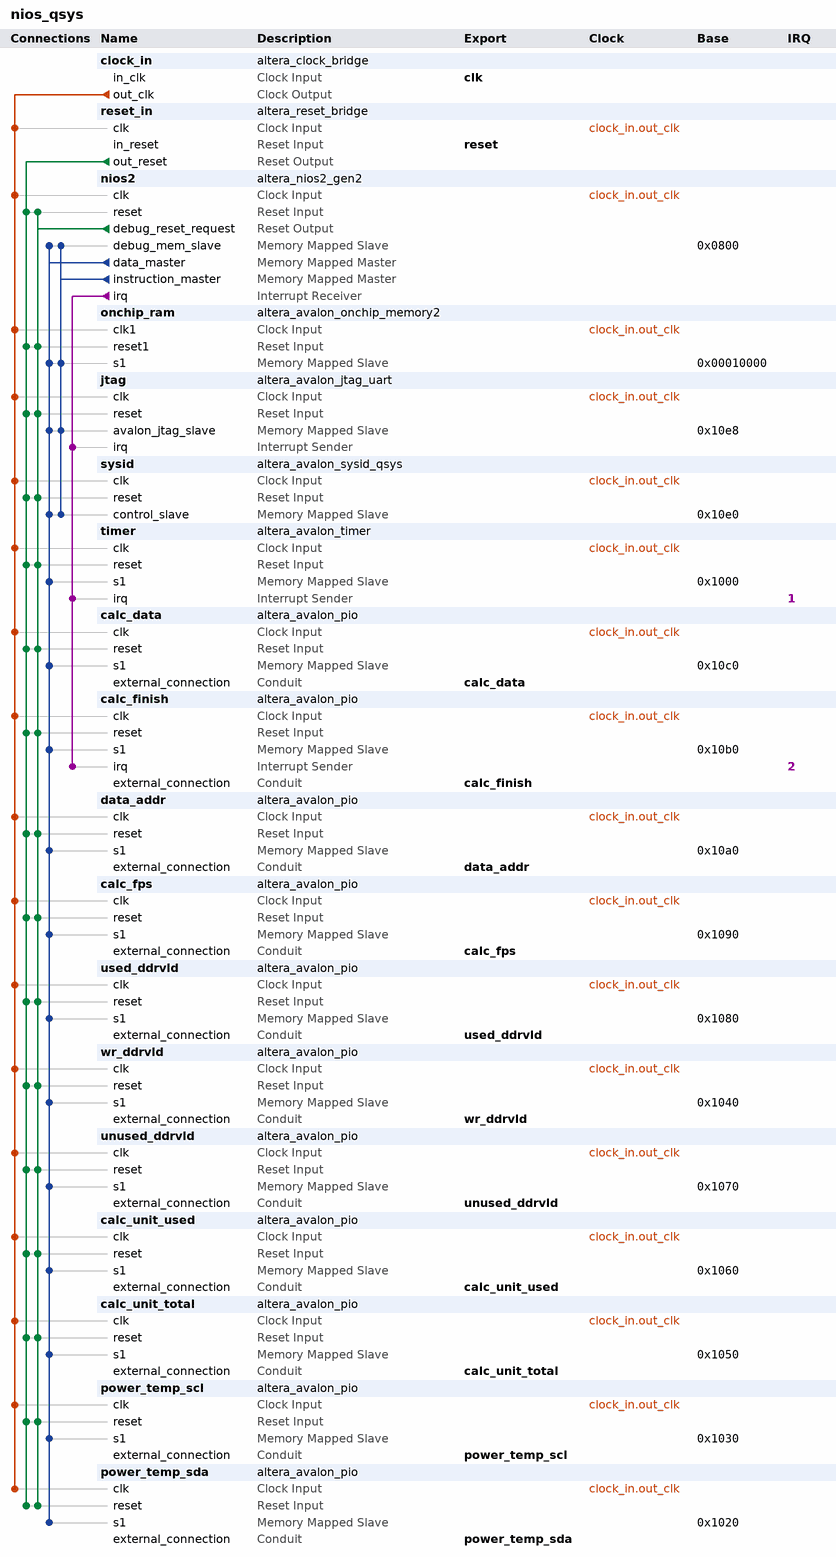
[diagram p0: system contents]
# Platform Designer (Qsys) system nios_qsys, Arria 10 10AX066K3F40E2SG
# Parameters at their usual value, and those the tool derives, are not listed.
package require -exact qsys 1.0
create_system nios_qsys
set_project_property DEVICE_FAMILY {Arria 10}
set_project_property DEVICE 10AX066K3F40E2SG

add_component clock_in ip/nios_qsys/nios_qsys_clock_in.ip altera_clock_bridge clock_in 18.1
load_component clock_in
set_component_parameter_value DERIVED_CLOCK_RATE 0
set_component_parameter_value EXPLICIT_CLOCK_RATE 125000000
save_component

add_component reset_in ip/nios_qsys/nios_qsys_reset_in.ip altera_reset_bridge reset_in 18.1
load_component reset_in
set_component_parameter_value ACTIVE_LOW_RESET 0
set_component_parameter_value SYNCHRONOUS_EDGES deassert
set_component_parameter_value SYNC_RESET 0
save_component

add_component nios2 ip/nios_qsys/nios_qsys_nios2_gen2_0.ip altera_nios2_gen2 nios2 18.1
load_component nios2
set_component_parameter_value resetSlave onchip_ram.s1
set_component_parameter_value exceptionSlave onchip_ram.s1
set_component_parameter_value impl Fast
set_component_parameter_value icache_size 2048
set_component_parameter_value dcache_size 2048
save_component

add_component onchip_ram ip/nios_qsys/nios_qsys_onchip_memory2_0.ip altera_avalon_onchip_memory2 onchip_ram 18.1
load_component onchip_ram
set_component_parameter_value dataWidth 32
set_component_parameter_value dualPort false
set_component_parameter_value initMemContent true
set_component_parameter_value initializationFileName onchip_mem.hex
set_component_parameter_value memorySize 65536
save_component

add_component jtag ip/nios_qsys/nios_qsys_jtag_uart_0.ip altera_avalon_jtag_uart jtag 18.1
load_component jtag
set_component_parameter_value simInteractiveOptions NO_INTERACTIVE_WINDOWS
save_component

add_component sysid ip/nios_qsys/nios_qsys_sysid_qsys_0.ip altera_avalon_sysid_qsys sysid 18.1
load_component sysid
set_component_parameter_value id 0
set_component_parameter_value ID_VALUE 0
set_component_parameter_value TIMESTAMP 0
save_component

add_component timer ip/nios_qsys/nios_qsys_timer_0.ip altera_avalon_timer timer 18.1
load_component timer
set_component_parameter_value period 1
set_component_parameter_value periodUnits SEC
set_component_parameter_value timerPreset FULL_FEATURED
save_component

add_component calc_data ip/nios_qsys/nios_qsys_pio_0.ip altera_avalon_pio calc_data 18.1
load_component calc_data
set_component_parameter_value direction Input
set_component_parameter_value width 32
save_component

add_component calc_finish ip/nios_qsys/nios_qsys_pio_1.ip altera_avalon_pio calc_finish 18.1
load_component calc_finish
set_component_parameter_value captureEdge true
set_component_parameter_value direction Input
set_component_parameter_value generateIRQ true
set_component_parameter_value irqType EDGE
set_component_parameter_value width 1
save_component

add_component data_addr ip/nios_qsys/nios_qsys_pio_2.ip altera_avalon_pio data_addr 18.1
load_component data_addr
set_component_parameter_value direction Output
set_component_parameter_value width 32
save_component

add_component calc_fps ip/nios_qsys/nios_qsys_pio_3.ip altera_avalon_pio calc_fps 18.1
load_component calc_fps
set_component_parameter_value direction Input
set_component_parameter_value width 32
save_component

add_component used_ddrvld ip/nios_qsys/nios_qsys_pio_4.ip altera_avalon_pio used_ddrvld 18.1
load_component used_ddrvld
set_component_parameter_value direction Input
set_component_parameter_value width 32
save_component

add_component wr_ddrvld ip/nios_qsys/nios_qsys_pio_8.ip altera_avalon_pio wr_ddrvld 18.1
load_component wr_ddrvld
set_component_parameter_value direction Input
set_component_parameter_value width 32
save_component

add_component unused_ddrvld ip/nios_qsys/nios_qsys_pio_5.ip altera_avalon_pio unused_ddrvld 18.1
load_component unused_ddrvld
set_component_parameter_value direction Input
set_component_parameter_value width 32
save_component

add_component calc_unit_used ip/nios_qsys/nios_qsys_pio_6.ip altera_avalon_pio calc_unit_used 18.1
load_component calc_unit_used
set_component_parameter_value direction Input
set_component_parameter_value width 32
save_component

add_component calc_unit_total ip/nios_qsys/nios_qsys_pio_7.ip altera_avalon_pio calc_unit_total 18.1
load_component calc_unit_total
set_component_parameter_value direction Input
set_component_parameter_value width 32
save_component

add_component power_temp_scl ../monitor/ip/monitor/power_temp_scl.ip altera_avalon_pio power_temp_scl 18.1

add_component power_temp_sda ../monitor/ip/monitor/power_temp_sda.ip altera_avalon_pio power_temp_sda 18.1

# connections
add_connection clock_in.out_clk calc_data.clk clock
add_connection clock_in.out_clk calc_finish.clk clock
add_connection clock_in.out_clk calc_fps.clk clock
add_connection clock_in.out_clk calc_unit_total.clk clock
add_connection clock_in.out_clk calc_unit_used.clk clock
add_connection clock_in.out_clk data_addr.clk clock
add_connection clock_in.out_clk jtag.clk clock
add_connection clock_in.out_clk nios2.clk clock
add_connection clock_in.out_clk onchip_ram.clk1 clock
add_connection clock_in.out_clk power_temp_scl.clk clock
add_connection clock_in.out_clk power_temp_sda.clk clock
add_connection clock_in.out_clk reset_in.clk clock
add_connection clock_in.out_clk sysid.clk clock
add_connection clock_in.out_clk timer.clk clock
add_connection clock_in.out_clk unused_ddrvld.clk clock
add_connection clock_in.out_clk used_ddrvld.clk clock
add_connection clock_in.out_clk wr_ddrvld.clk clock
add_connection nios2.debug_reset_request calc_data.reset reset
add_connection nios2.debug_reset_request calc_finish.reset reset
add_connection nios2.debug_reset_request calc_fps.reset reset
add_connection nios2.debug_reset_request calc_unit_total.reset reset
add_connection nios2.debug_reset_request calc_unit_used.reset reset
add_connection nios2.debug_reset_request data_addr.reset reset
add_connection nios2.debug_reset_request jtag.reset reset
add_connection nios2.debug_reset_request nios2.reset reset
add_connection nios2.debug_reset_request onchip_ram.reset1 reset
add_connection nios2.debug_reset_request power_temp_scl.reset reset
add_connection nios2.debug_reset_request power_temp_sda.reset reset
add_connection nios2.debug_reset_request sysid.reset reset
add_connection nios2.debug_reset_request timer.reset reset
add_connection nios2.debug_reset_request unused_ddrvld.reset reset
add_connection nios2.debug_reset_request used_ddrvld.reset reset
add_connection nios2.debug_reset_request wr_ddrvld.reset reset
add_connection reset_in.out_reset calc_data.reset reset
add_connection reset_in.out_reset calc_finish.reset reset
add_connection reset_in.out_reset calc_fps.reset reset
add_connection reset_in.out_reset calc_unit_total.reset reset
add_connection reset_in.out_reset calc_unit_used.reset reset
add_connection reset_in.out_reset data_addr.reset reset
add_connection reset_in.out_reset jtag.reset reset
add_connection reset_in.out_reset nios2.reset reset
add_connection reset_in.out_reset onchip_ram.reset1 reset
add_connection reset_in.out_reset power_temp_scl.reset reset
add_connection reset_in.out_reset power_temp_sda.reset reset
add_connection reset_in.out_reset sysid.reset reset
add_connection reset_in.out_reset timer.reset reset
add_connection reset_in.out_reset unused_ddrvld.reset reset
add_connection reset_in.out_reset used_ddrvld.reset reset
add_connection reset_in.out_reset wr_ddrvld.reset reset
add_connection nios2.data_master calc_data.s1 avalon
set_connection_parameter_value nios2.data_master/calc_data.s1 baseAddress 0x10c0
add_connection nios2.data_master calc_finish.s1 avalon
set_connection_parameter_value nios2.data_master/calc_finish.s1 baseAddress 0x10b0
add_connection nios2.data_master calc_fps.s1 avalon
set_connection_parameter_value nios2.data_master/calc_fps.s1 baseAddress 0x1090
add_connection nios2.data_master calc_unit_total.s1 avalon
set_connection_parameter_value nios2.data_master/calc_unit_total.s1 baseAddress 0x1050
add_connection nios2.data_master calc_unit_used.s1 avalon
set_connection_parameter_value nios2.data_master/calc_unit_used.s1 baseAddress 0x1060
add_connection nios2.data_master data_addr.s1 avalon
set_connection_parameter_value nios2.data_master/data_addr.s1 baseAddress 0x10a0
add_connection nios2.data_master jtag.avalon_jtag_slave avalon
set_connection_parameter_value nios2.data_master/jtag.avalon_jtag_slave baseAddress 0x10e8
add_connection nios2.data_master nios2.debug_mem_slave avalon
set_connection_parameter_value nios2.data_master/nios2.debug_mem_slave baseAddress 0x0800
add_connection nios2.data_master onchip_ram.s1 avalon
set_connection_parameter_value nios2.data_master/onchip_ram.s1 baseAddress 0x00010000
add_connection nios2.data_master power_temp_scl.s1 avalon
set_connection_parameter_value nios2.data_master/power_temp_scl.s1 baseAddress 0x1030
add_connection nios2.data_master power_temp_sda.s1 avalon
set_connection_parameter_value nios2.data_master/power_temp_sda.s1 baseAddress 0x1020
add_connection nios2.data_master sysid.control_slave avalon
set_connection_parameter_value nios2.data_master/sysid.control_slave baseAddress 0x10e0
add_connection nios2.data_master timer.s1 avalon
set_connection_parameter_value nios2.data_master/timer.s1 baseAddress 0x1000
add_connection nios2.data_master unused_ddrvld.s1 avalon
set_connection_parameter_value nios2.data_master/unused_ddrvld.s1 baseAddress 0x1070
add_connection nios2.data_master used_ddrvld.s1 avalon
set_connection_parameter_value nios2.data_master/used_ddrvld.s1 baseAddress 0x1080
add_connection nios2.data_master wr_ddrvld.s1 avalon
set_connection_parameter_value nios2.data_master/wr_ddrvld.s1 baseAddress 0x1040
add_connection nios2.instruction_master jtag.avalon_jtag_slave avalon
set_connection_parameter_value nios2.instruction_master/jtag.avalon_jtag_slave baseAddress 0x10e8
add_connection nios2.instruction_master nios2.debug_mem_slave avalon
set_connection_parameter_value nios2.instruction_master/nios2.debug_mem_slave baseAddress 0x0800
add_connection nios2.instruction_master onchip_ram.s1 avalon
set_connection_parameter_value nios2.instruction_master/onchip_ram.s1 baseAddress 0x00010000
add_connection nios2.instruction_master sysid.control_slave avalon
set_connection_parameter_value nios2.instruction_master/sysid.control_slave baseAddress 0x10e0
add_connection nios2.irq calc_finish.irq interrupt
set_connection_parameter_value nios2.irq/calc_finish.irq irqNumber 2
add_connection nios2.irq jtag.irq interrupt
add_connection nios2.irq timer.irq interrupt
set_connection_parameter_value nios2.irq/timer.irq irqNumber 1

# exported interfaces
add_interface calc_data conduit end
set_interface_property calc_data EXPORT_OF calc_data.external_connection
add_interface calc_finish conduit end
set_interface_property calc_finish EXPORT_OF calc_finish.external_connection
add_interface calc_fps conduit end
set_interface_property calc_fps EXPORT_OF calc_fps.external_connection
add_interface calc_unit_total conduit end
set_interface_property calc_unit_total EXPORT_OF calc_unit_total.external_connection
add_interface calc_unit_used conduit end
set_interface_property calc_unit_used EXPORT_OF calc_unit_used.external_connection
add_interface clk clock sink
set_interface_property clk EXPORT_OF clock_in.in_clk
add_interface data_addr conduit end
set_interface_property data_addr EXPORT_OF data_addr.external_connection
add_interface power_temp_scl conduit end
set_interface_property power_temp_scl EXPORT_OF power_temp_scl.external_connection
add_interface power_temp_sda conduit end
set_interface_property power_temp_sda EXPORT_OF power_temp_sda.external_connection
add_interface reset reset sink
set_interface_property reset EXPORT_OF reset_in.in_reset
add_interface unused_ddrvld conduit end
set_interface_property unused_ddrvld EXPORT_OF unused_ddrvld.external_connection
add_interface used_ddrvld conduit end
set_interface_property used_ddrvld EXPORT_OF used_ddrvld.external_connection
add_interface wr_ddrvld conduit end
set_interface_property wr_ddrvld EXPORT_OF wr_ddrvld.external_connection

set_interconnect_requirement {$system} qsys_mm.clockCrossingAdapter HANDSHAKE
set_interconnect_requirement {$system} qsys_mm.enableEccProtection FALSE
set_interconnect_requirement {$system} qsys_mm.insertDefaultSlave FALSE
set_interconnect_requirement {$system} qsys_mm.maxAdditionalLatency 1

save_system nios_qsys.qsys
